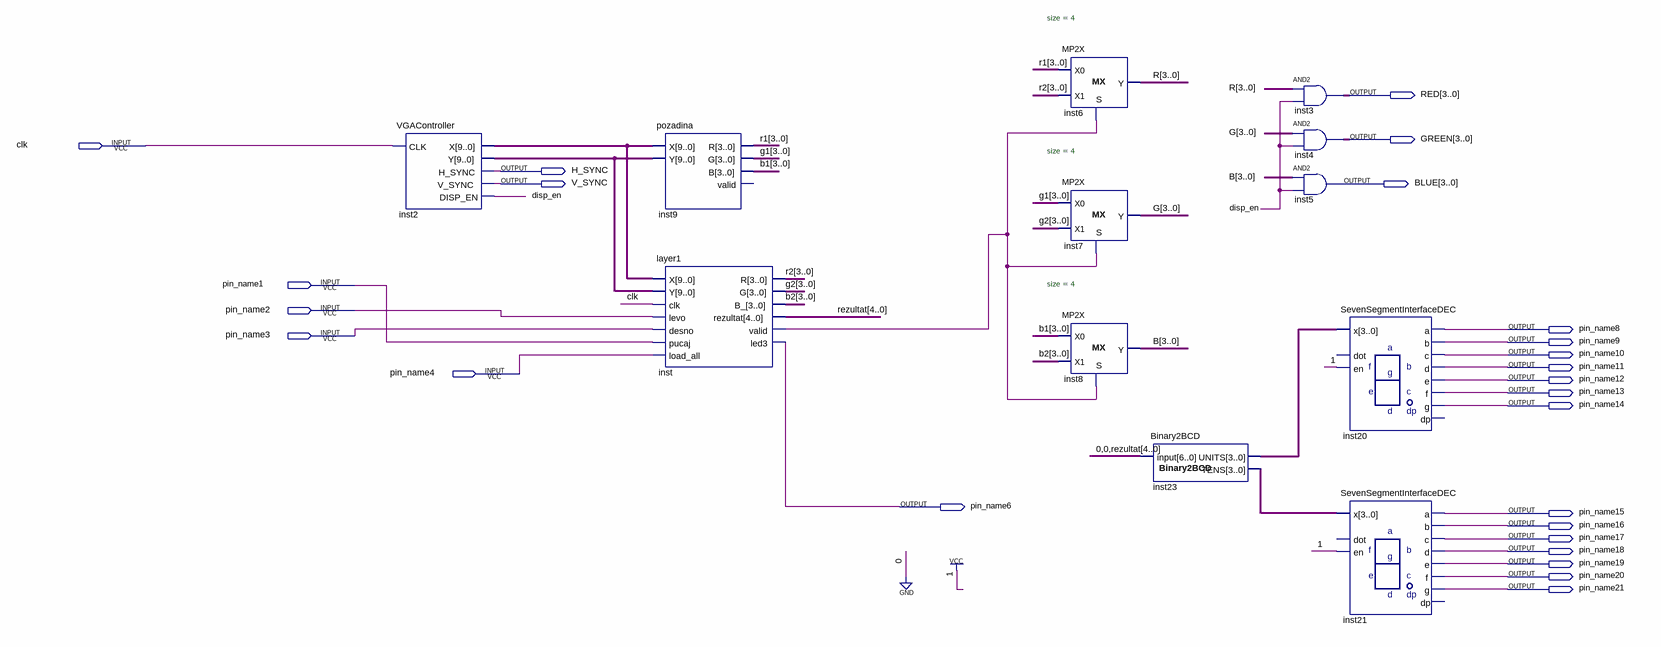
[diagram p0: schematic sheet]
// Quartus schematic projekat.bdf as structural Verilog: 12 symbols, 25 pins
module projekat (
  input  clk,
  input  pin_name1,
  input  pin_name2,
  input  pin_name3,
  input  pin_name4,
  output [3:0] RED,
  output [3:0] GREEN,
  output H_SYNC,
  output V_SYNC,
  output [3:0] BLUE,
  output pin_name8,
  output pin_name9,
  output pin_name10,
  output pin_name11,
  output pin_name12,
  output pin_name13,
  output pin_name14,
  output pin_name6,
  output pin_name15,
  output pin_name16,
  output pin_name17,
  output pin_name18,
  output pin_name19,
  output pin_name20,
  output pin_name21
);

  wire disp_en, inst_valid;
  wire [3:0] B, b1, b2, G, g1, g2, inst23_bcd_tens, inst23_bcd_units, R, r1, r2;
  wire [4:0] rezultat;
  wire [9:0] inst2_x, inst2_y;

  VGAController inst2 (.CLK(clk), .X(inst2_x), .Y(inst2_y), .H_SYNC(H_SYNC), .V_SYNC(V_SYNC), .DISP_EN(disp_en));
  pozadina inst9 (.X(inst2_x), .Y(inst2_y), .R(r1), .G(g1), .B(b1));  // open: valid
  layer1 inst (
    .X(inst2_x), .Y(inst2_y), .clk(clk), .levo(pin_name2), .desno(pin_name3), .pucaj(pin_name1),
    .load_all(pin_name4), .R(r2), .G(g2), .B_(b2), .rezultat(rezultat), .valid(inst_valid), .led3(pin_name6));
  MP2X #(.size(4)) inst6 (.S(inst_valid), .X0(r1), .X1(r2), .Y(R));
  MP2X #(.size(4)) inst7 (.S(inst_valid), .X0(g1), .X1(g2), .Y(G));
  MP2X #(.size(4)) inst8 (.S(inst_valid), .X0(b1), .X1(b2), .Y(B));
  Binary2BCD inst23 (.binary_input({2'b00, rezultat}), .bcd_units(inst23_bcd_units), .bcd_tens(inst23_bcd_tens));
  assign RED = R & {4{disp_en}};  // AND2 inst3, 4 bits wide
  assign GREEN = G & {4{disp_en}};  // AND2 inst4, 4 bits wide
  assign BLUE = B & {4{disp_en}};  // AND2 inst5, 4 bits wide
  SevenSegmentInterfaceDEC inst20 (
    .en(1'b1), .x(inst23_bcd_units), .a(pin_name8), .b(pin_name9), .c(pin_name10), .d(pin_name11),
    .e(pin_name12), .f(pin_name13), .g(pin_name14));  // open: dot, dp
  SevenSegmentInterfaceDEC inst21 (
    .en(1'b1), .x(inst23_bcd_tens), .a(pin_name15), .b(pin_name16), .c(pin_name17), .d(pin_name18),
    .e(pin_name19), .f(pin_name20), .g(pin_name21));  // open: dot, dp
endmodule
